# Altium schematic sheet WalkMod B0.SchDoc: =ProjectTitle
size A4; DrawnBy: TheComet; Engineer: TheComet; SheetNumber: 1; SheetTotal: 1
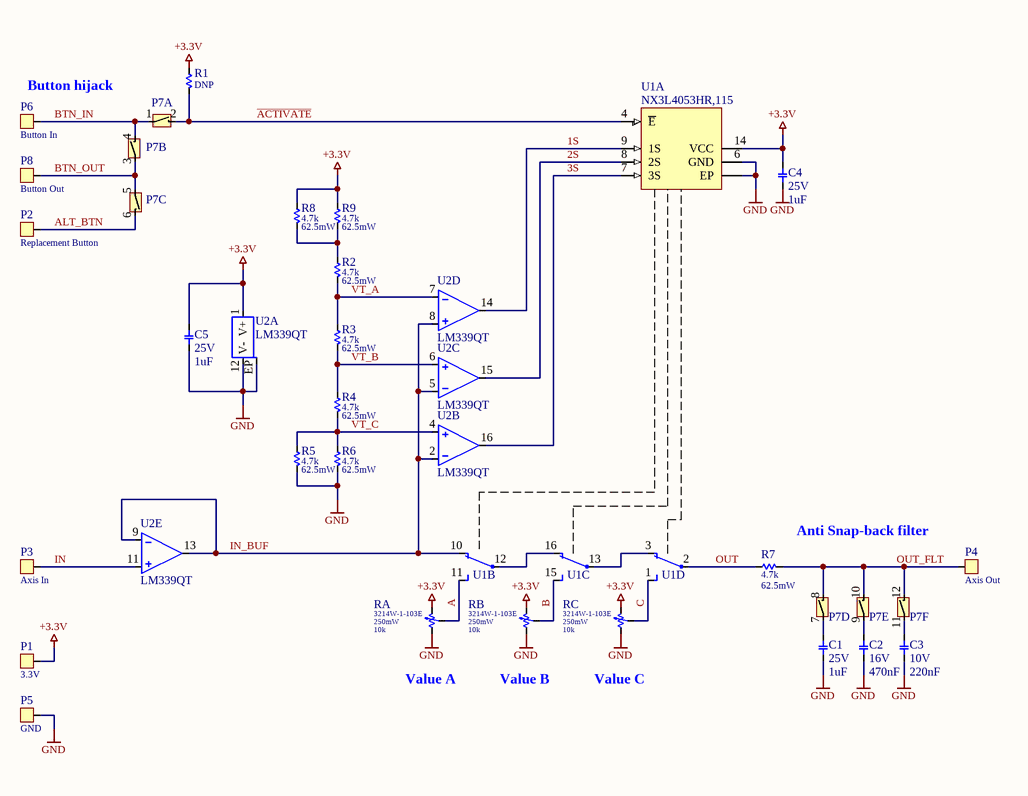
[diagram p0: WalkMod B0.SchDoc]

## Parts
C1  value 1uF  Value2: 25V  [CX7R0603K]  (hidden comment: CL10B105KA8NFNC)
C2  value 470nF  Value2: 16V  [CX7R0603K]  (hidden comment: CL10B474KO8NFNC)
C3  value 220nF  Value2: 10V  [CX7R0603K]  (hidden comment: CC0603KRX7R6BB224)
C4  value 1uF  Value2: 25V  [CX7R0603K]  (hidden comment: CL10B105KA8NFNC)
C5  value 1uF  Value2: 25V  [CX7R0603K]  (hidden comment: CL10B105KA8NFNC)
P1  Name: 3.3V  [PAD_2X1.5_SQUARE]  (hidden comment: SMD Pad 1 pin)
P2  Name: Replacement Button  [PAD_2X1.5_SQUARE]  (hidden comment: SMD Pad 1 pin)
P3  Name: Axis In  [PAD_2X1.5_SQUARE]  (hidden comment: SMD Pad 1 pin)
P4  Name: Axis Out  [PAD_2X1.5_SQUARE]  (hidden comment: SMD Pad 1 pin)
P5  Name: GND  [PAD_2X1.5_SQUARE]  (hidden comment: SMD Pad 1 pin)
P6  Name: Button In  [PAD_2X1.5_SQUARE]  (hidden comment: SMD Pad 1 pin)
P7  DS05-127-2-06BK-SMT-TR  [CUI-DS05-127-2-06BK-SMT_C]  (value not drawn)  (parts A,B,C,D,E,F of 6)
P8  Name: Button Out  [PAD_2X1.5_SQUARE]  (hidden comment: SMD Pad 1 pin)
R1  DNP  [AT0402_C]
R2  value 4.7k  Value2: 62.5mW  [RT0402_C]  (hidden comment: RG1005P-472-B-T5)
R3  value 4.7k  Value2: 62.5mW  [RT0402_C]  (hidden comment: RG1005P-472-B-T5)
R4  value 4.7k  Value2: 62.5mW  [RT0402_C]  (hidden comment: RG1005P-472-B-T5)
R5  value 4.7k  Value2: 62.5mW  [RT0402_C]  (hidden comment: RG1005P-472-B-T5)
R6  value 4.7k  Value2: 62.5mW  [RT0402_C]  (hidden comment: RG1005P-472-B-T5)
R7  value 4.7k  Value2: 62.5mW  [RT0402_C]  (hidden comment: RG1005P-472-B-T5)
R8  value 4.7k  Value2: 62.5mW  [RT0402_C]  (hidden comment: RG1005P-472-B-T5)
R9  value 4.7k  Value2: 62.5mW  [RT0402_C]  (hidden comment: RG1005P-472-B-T5)
RA  3214W-1-103E  value 10k  Value2: 250mW  [BOURNS_3214W_C]
RB  3214W-1-103E  value 10k  Value2: 250mW  [BOURNS_3214W_C]
RC  3214W-1-103E  value 10k  Value2: 250mW  [BOURNS_3214W_C]
U1  NX3L4053HR,115  [HXQFN16_SOT1039-2_C]  (parts A,B,C,D of 4)
U2  LM339QT  [QFN16_0.5_C]  (parts A,B,C,D,E of 5)

## Nets
+3.3V: C4.2 C5.2 P1.1 R1.1 R8.2 R9.2 RA.3 RB.3 RC.3 U1.14(VCC) U2.1(V+)
GND: C1.1 C2.1 C3.1 C4.1 C5.1 P5.1 R5.1 R6.1 RA.1 RB.1 RC.1 U1.6(GND) U1.EP U2.12(V-) U2.EP
1S: U1.9(1S) U2.14(OUT3)
2S: U1.8(2S) U2.15(OUT2)
3S: U1.7(3S) U2.16(OUT1)
A: RA.2 U1.11(1Y1)
~{ACTIVATE}: P7.2 R1.2 U1.4(~{E})
ALT_BTN: P2.1 P7.6
B: RB.2 U1.15(2Y1)
BTN_IN: P6.1 P7.1 P7.4
BTN_OUT: P7.3 P7.5 P8.1
C: RC.2 U1.1(3Y1)
IN: P3.1 U2.11(IN+4)
IN_BUF: U1.10(1Y0) U2.2(IN-1) U2.5(IN-2) U2.8(IN+3) U2.9(IN-4) U2.13(OUT4)
OUT: R7.2 U1.2(3Z)
OUT_FLT: P4.1 P7.8 P7.10 P7.12 R7.1
VT_A: R2.1 R3.2 U2.7(IN-3)
VT_B: R3.1 R4.2 U2.6(IN+2)
VT_C: R4.1 R5.2 R6.2 U2.4(IN+1)
NetC1_2: C1.2 P7.7
NetC2_2: C2.2 P7.9
NetC3_2: C3.2 P7.11
NetR2_2: R2.2 R8.1 R9.1
NetU1_3: U1.3(3Y0) U1.13(2Z)
NetU1_12: U1.12(1Z) U1.16(2Y0)

## Notes on the sheet
- Button hijack
- Anti Snap-back filter
- (near RA) Value A
- (near RB) Value B
- (near RC) Value C

## Library data of the parts
C1 C4 C5 = kyocera-C-X7R-0603: 1 µF ±10% 25V Ceramic Capacitor X7R 0603 (1608 Metric); Size: 0603; Type: CL10B105KA8NFNC
C2 = kyocera-C-X7R-0603: 0.47 µF ±10% 16V Ceramic Capacitor X7R 0603 (1608 Metric); Size: 0603; Type: CL10B474KO8NFNC
C3 = kyocera-C-X7R-0603: 0.22 µF ±10% 10V Ceramic Capacitor X7R 0603 (1608 Metric); Size: 0603; Type: CC0603KRX7R6BB224
P1-P6 P8 = SMD Pad 1 pin: Single SMD Pad
P7 = DS05-127-2-06BK-SMT-TR: Dip Switch SPST 6 Position Surface Mount Slide (Standard) Actuator 25mA 24VDC; Type: DS05-127-2-06BK-SMT-TR
R1 = AT0402FRE0710KL: 10 kOhms ±1% 0.063W, 1/16W Chip Resistor 0402 (1005 Metric) Anti-Sulfur, Automotive AEC-Q200, Moisture Resistant Thin Film; Value2: 62.5mW; Type: DNP; Value: DNP
R2-R9 = RT0402DRD0747KL: 4.7 kOhms ±0.1% 0.063W, 1/16W Chip Resistor 0402 (1005 Metric) Anti-Sulfur, Automotive AEC-Q200 Thin Film; Type: RG1005P-472-B-T5
RA RB RC = 3214W-1-103E: 10 kOhms 0.25W, 1/4W J Lead Surface Mount Trimmer Potentiometer Cermet 5.0 Turn Top Adjustment; Type: 3214W-1-103E
U1 = NX3L4053: 3 Circuit IC Switch 2:1 800mOhm 16-HXQFN (3x3); Manufacturer Part Number 1: NXP USA Inc.; Type: NX3L4053HR,115; Manufacturer 1: NX3L4053HR,115
U2 = LM339QT: Comparator General Purpose CMOS, DTL, ECL, MOS, Open-Collector, TTL 16-QFN (3x3); Manufacturer 1: STMicroelectronics; Type: LM339QT; Manufacturer Part Number 1: LM339QT